# Altium schematic sheet Plugs.SchDoc
size A4
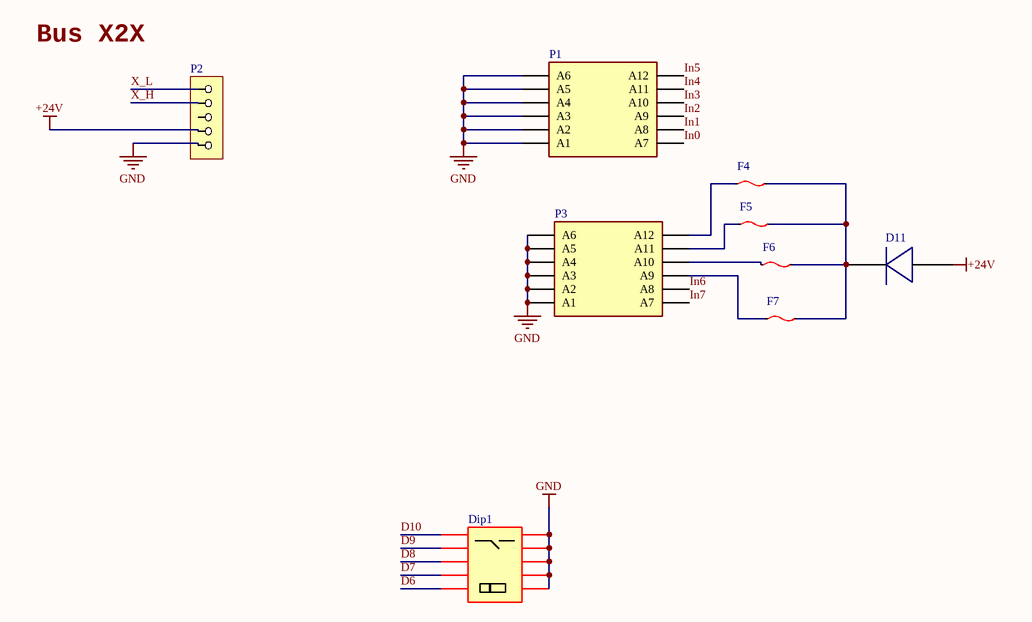
[diagram p0: Plugs.SchDoc]

## Parts
D11  (no value)  [B340A-13-F]
Dip1  (no value)  [DipSwitch 5]
F4  (no value)  [MSMF]
F5  (no value)  [MSMF]
F6  (no value)  [MSMF]
F7  (no value)  [MSMF]
P1  (no value)  [mcd 1,5/6-G1-3.81]
P2  (no value)  [PhClass5]
P3  (no value)  [mcd 1,5/6-G1-3.81]

## Nets
+24V: D11.2 P2.4
GND: Dip1.1 Dip1.2 Dip1.3 Dip1.4 Dip1.5 P1.1(A6) P1.3(A5) P1.5(A4) P1.7(A3) P1.9(A2) P1.11(A1) P2.5 P3.1(A6) P3.3(A5) P3.5(A4) P3.7(A3) P3.9(A2) P3.11(A1)
D6: Dip1.16
D7: Dip1.15
D8: Dip1.14
D9: Dip1.13
D10: Dip1.12
In0: P1.12(A7)
In1: P1.10(A8)
In2: P1.8(A9)
In3: P1.6(A10)
In4: P1.4(A11)
In5: P1.2(A12)
In6: P3.10(A8)
In7: P3.12(A7)
X_H: P2.2
X_L: P2.1
NetD11_1: D11.1 F4.1 F5.1 F6.1 F7.1
NetF4_0: F4.0 P3.2(A12)
NetF5_0: F5.0 P3.4(A11)
NetF6_0: F6.0 P3.6(A10)
NetF7_0: F7.0 P3.8(A9)

Not connected (* = marked no-connect by the designer): P2 3

## Notes on the sheet
- Bus X2X

## Library data of the parts
D11 = B340A-13-F: Part Description: Schottky Diode 60V 3A; Part Number: B360A-13-F
Dip1 = DipSwitch5: Part Description: Bit Switch; Part Number: DS1040-05RT
F4-F7 = MSMF: Part Description: PPTC 60V 100MA; Part Number: MF-MSMF010-2
P1 P3 = MCD 1.5/6 Phoenix: Part Description: Pluggable Terminal Blocks; LatestRevisionDate: 17-Jul-2002; LatestRevisionNote: Re-released for DXP Platform.; Publisher: Altium Limited; Part Number: MCD 1.5/6 Phoenix
P2 = EMSTBA 2.5/5-G-5.08: Part Description: Pluggable Terminal Blocks 5 Pos; Part Number: MSTBA 2,5/ 5-G-5,08 - 1757271